# EAGLE schematic Connectors-MK2 (EAGLE 9.6.2)
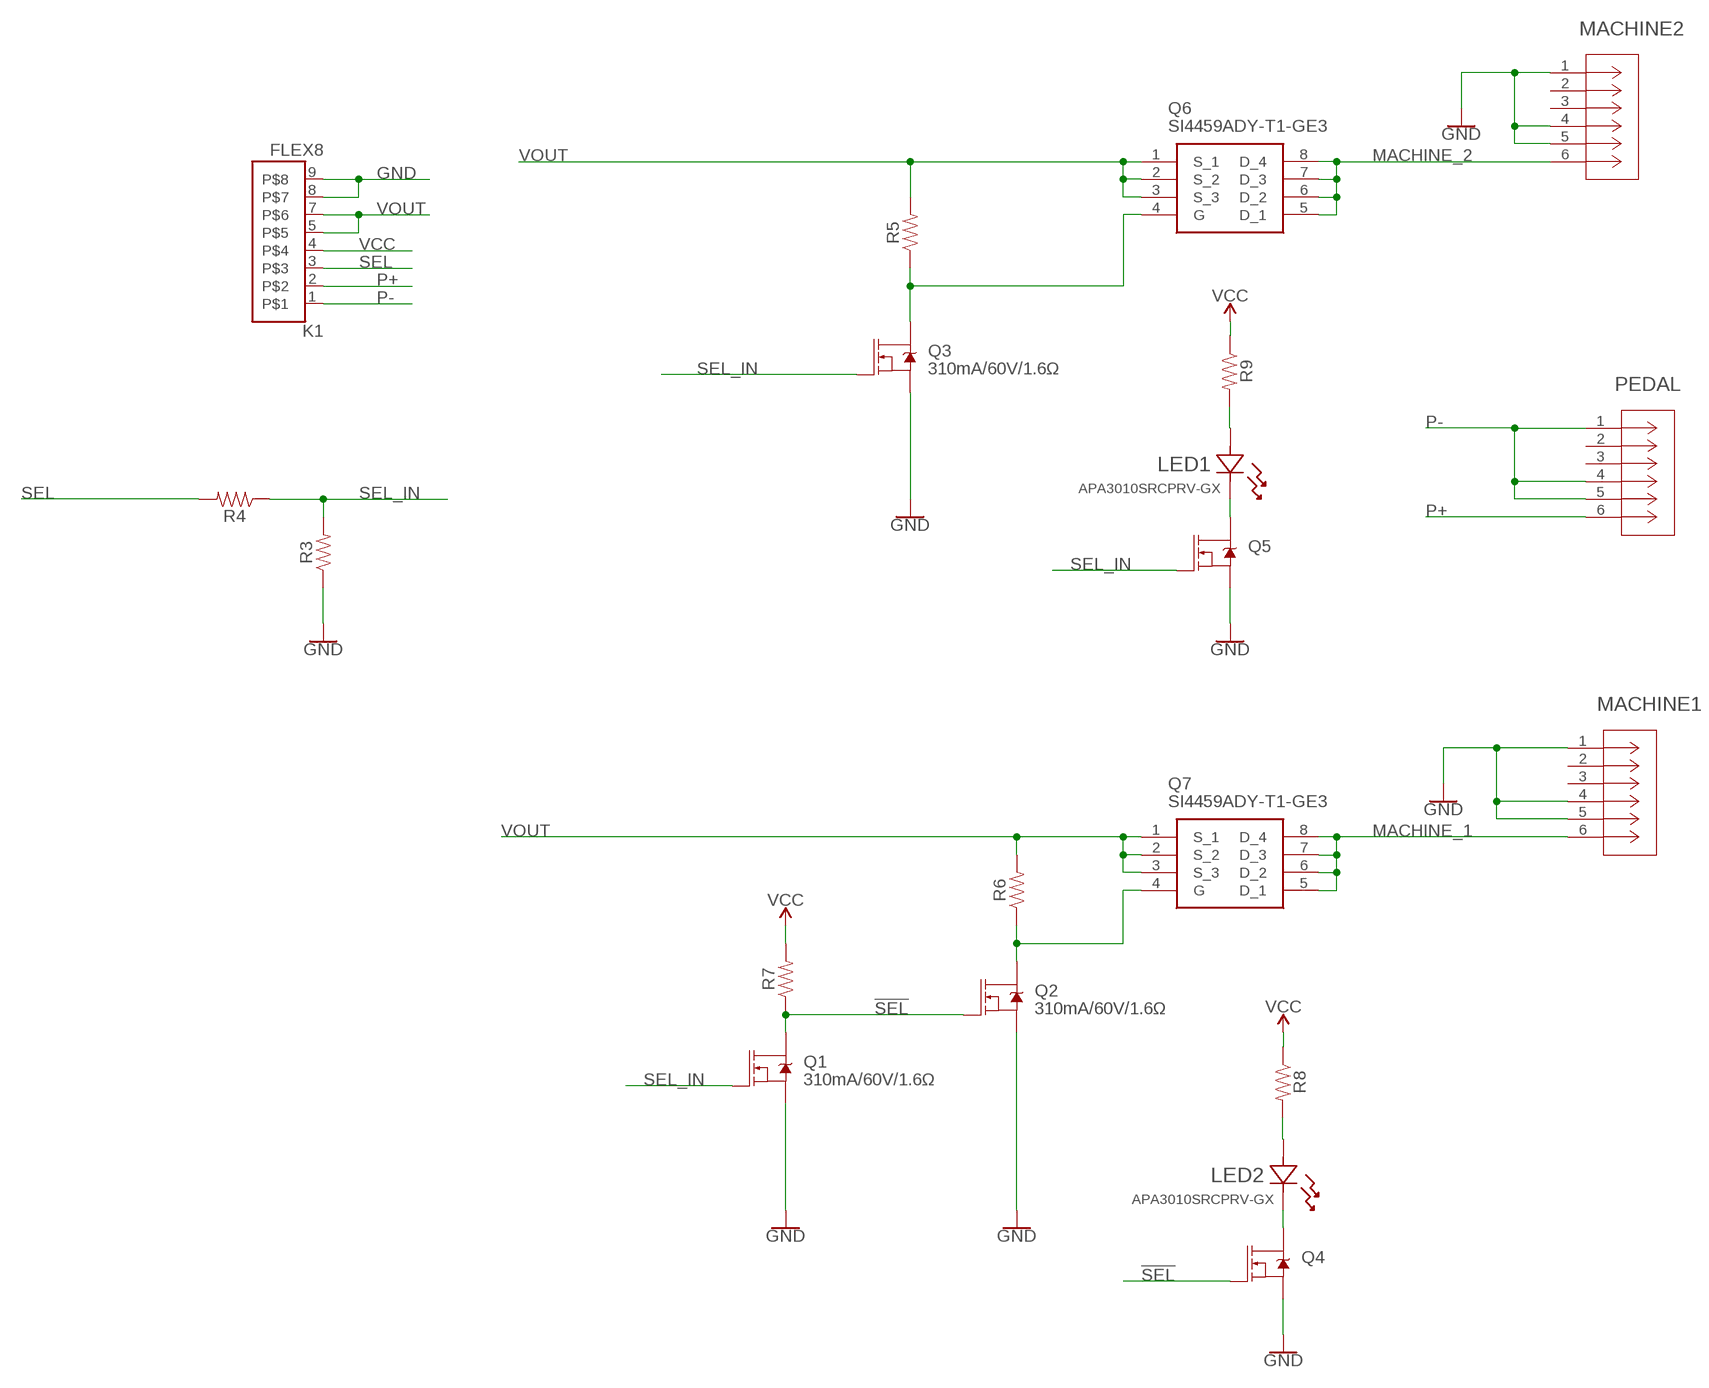
[diagram p0: schematic, sheet 1]

## Parts
K1  FLEX8  [FLEX8]
LED1  APA3010SRCPRV-GX  [LED_APA3010SRCPRV-GX_KNB]
LED2  APA3010SRCPRV-GX  [LED_APA3010SRCPRV-GX_KNB]
MACHINE1  ACJS-MHDR  [CONN_MHDR_AMP]
MACHINE2  ACJS-MHDR  [CONN_MHDR_AMP]
PEDAL  ACJS-MHDR  [CONN_MHDR_AMP]
Q1  310mA/60V/1.6Ω  MOSFET-NCH-2N7002PW  [SOT323]
Q2  310mA/60V/1.6Ω  MOSFET-NCH-2N7002PW  [SOT323]
Q3  310mA/60V/1.6Ω  MOSFET-NCH-2N7002PW  [SOT323]
Q4  310mA/60V/1.6Ω  MOSFET-NCH-2N7002PW  [SOT323]
Q5  310mA/60V/1.6Ω  MOSFET-NCH-2N7002PW  [SOT323]
Q6  SI4459ADY-T1-GE3  [SOIC127P600X175-8N]
Q7  SI4459ADY-T1-GE3  [SOIC127P600X175-8N]
R3  RESISTOR0603  [0603]
R4  RESISTOR0603  [0603]
R5  RESISTOR0603  [0603]
R6  RESISTOR0603  [0603]
R7  RESISTOR0603  [0603]
R8  RESISTOR0805  [0805]
R9  RESISTOR0805  [0805]

## Nets
!SEL!: Q1.3(D) Q2.1(G) Q4.1(G) R7.1
GND: K1.8 K1.9 MACHINE1.1 MACHINE1.4 MACHINE1.5 MACHINE2.1 MACHINE2.4 MACHINE2.5 Q1.2(S) Q2.2(S) Q3.2(S) Q4.2(S) Q5.2(S) R3.1
MACHINE_1: MACHINE1.6 Q7.5(D_1) Q7.6(D_2) Q7.7(D_3) Q7.8(D_4)
MACHINE_2: MACHINE2.6 Q6.5(D_1) Q6.6(D_2) Q6.7(D_3) Q6.8(D_4)
N$4: Q2.3(D) Q7.4(G) R6.1
N$5: Q3.3(D) Q6.4(G) R5.1
N$6: LED2.2 R8.2
N$7: LED2.1 Q4.3(D)
N$9: LED1.2 R9.2
N$10: LED1.1 Q5.3(D)
P+: K1.2 PEDAL.6
P-: K1.1 PEDAL.1 PEDAL.4 PEDAL.5
SEL: K1.3 R4.2
SEL_IN: Q1.1(G) Q3.1(G) Q5.1(G) R3.2 R4.1
VCC: K1.4 R7.2 R8.1 R9.1
VOUT: K1.5 K1.7 Q6.1(S_1) Q6.2(S_2) Q6.3(S_3) Q7.1(S_1) Q7.2(S_2) Q7.3(S_3) R5.2 R6.2
Unconnected: MACHINE1.2 MACHINE1.3 MACHINE2.2 MACHINE2.3 PEDAL.2 PEDAL.3

## Library data of the parts
K1 = Flex_3mm:FLEX8: WR-FPC 1mm SMT Horiz. Bot. Contact Hinge type WR-FPC 1mm 08 pins Hinge type SMT Horizontal Bottom Contact ;=>Code : Con_FPC_ZIF_1.00_6861xx148922_686108148922 <http://katalog.we-online.de/media/images/eican/Con_FPC_ZIF_1.00_686110148922_pf2.jpg> Details see: http://katalog.we-online.de/em/datasheet/6861xx148922.pdf Created 2014-10-08, Karrer Zheng 2014 (C) Wurth Elektronik
LED1 LED2 = APA3010 Led:APA3010SRCPRV-GX; BUILT_BY: EMA_Cory; COPYRIGHT: Copyright (C) 2018 Accelerated Designs. All rights reserved; DATASHEET: https://www.kingbrightusa.com/images/catalog/SPEC/APA3010SRCPRV-GX.pdf; MANUFACTURER_PART_NUMBER: APA3010SRCPRV-GX; SOURCELIBRARY: Add_to_database_2020-11-13; VENDOR: Kingbright
MACHINE1 MACHINE2 PEDAL = ACJSMHDR:ACJS-MHDR; BUILT_BY: EMA_Matt; COPYRIGHT: Copyright (C) 2018 Accelerated Designs. All rights reserved; MANUFACTURER_PART_NUMBER: ACJS-MHDR; SOURCELIBRARY: Amphenol_2019-10-30; VENDOR: Amphenol
Q1-Q5 = SparkFun-DiscreteSemi:MOSFET-NCH: N-channel MOSFETs Voltage controlled devices that allow control of high current outputs. SparkFun Products: SparkFun OpenScale <https://www.sparkfun.com/products/13261> SparkFun Digital Sandbox <https://www.sparkfun.com/products/12651> SparkFun Monster Moto Shield <https://www.sparkfun.com/products/10182> SparkFun MOSFET Power Controller <https://www.sparkfun.com/products/11214>; PROD_ID: TRANS-11151
Q6 Q7 = SI4459ADY-T1-GE3:SI4459ADY-T1-GE3: Trans MOSFET P-CH 30V 29A 8-Pin SOIC N T/R Source: Datasheet <http://www.vishay.com/docs/69979/si4459ad.pdf>; ARROW_PART_NUMBER: SI4459ADY-T1-GE3; ARROW_PRICE-STOCK: https://www.arrow.com/en/products/si4459ady-t1-ge3/vishay; DESCRIPTION: Trans MOSFET P-CH 30V 29A 8-Pin SOIC N T/R; HEIGHT: 1.75mm; MANUFACTURER_NAME: Vishay; MANUFACTURER_PART_NUMBER: SI4459ADY-T1-GE3; MOUSER_PART_NUMBER: 781-SI4459ADY-T1-GE3; MOUSER_PRICE-STOCK: https://www.mouser.co.uk/ProductDetail/Vishay-Semiconductors/SI4459ADY-T1-GE3?qs=IRuQNBqMOcnyBuDcl66N0Q%3D%3D
R3-R9 = SparkFun-Resistors:RESISTOR: Generic Resistor Package